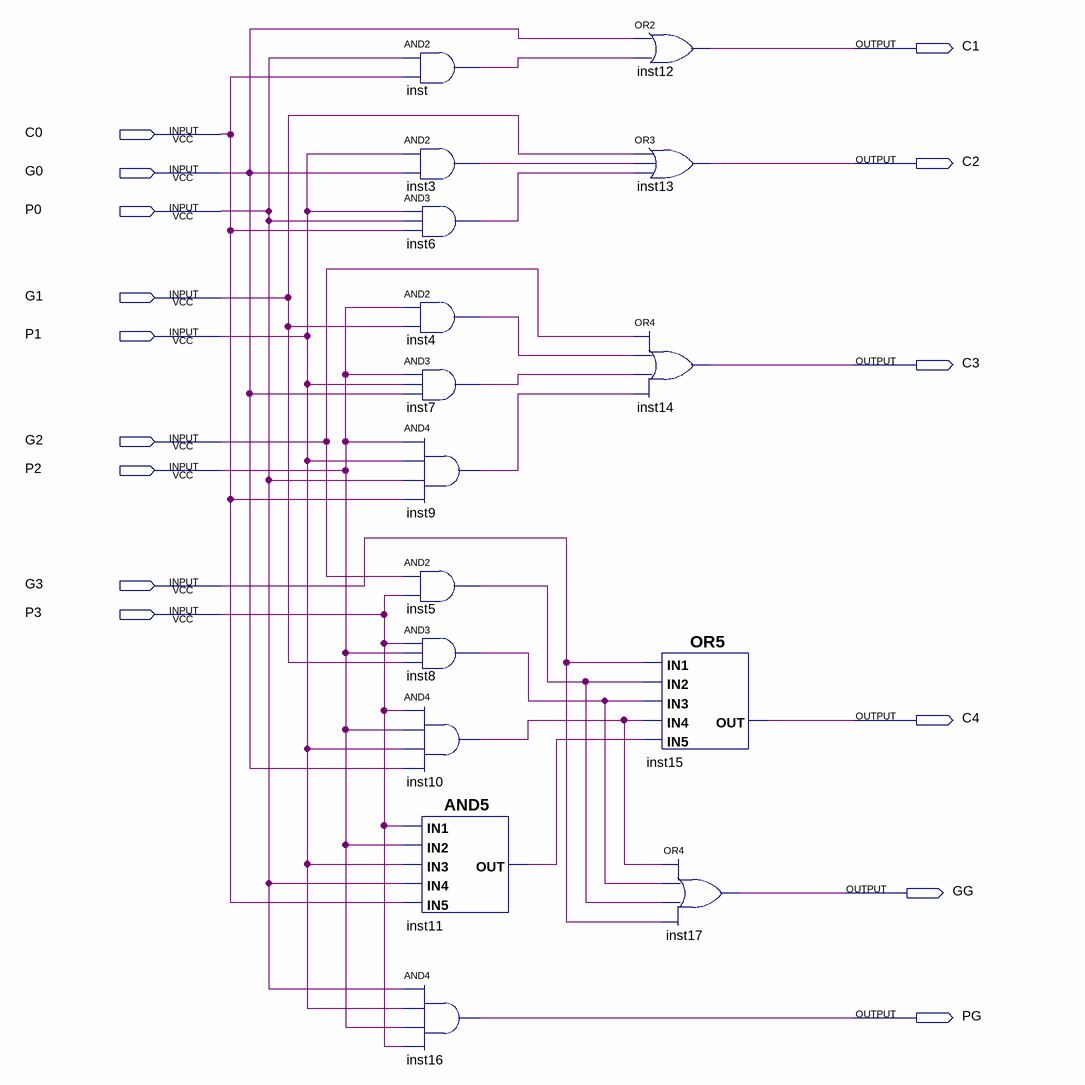
[diagram p0: schematic sheet]
// Quartus schematic CarryLookahead_4bit.bdf as structural Verilog: 16 symbols, 15 pins
module CarryLookahead_4bit (
  input  C0,
  input  G0,
  input  P0,
  input  G1,
  input  P1,
  input  G2,
  input  P2,
  input  G3,
  input  P3,
  output C1,
  output C2,
  output C3,
  output C4,
  output GG,
  output PG
);

  wire inst3_out, inst4_out, inst5_out, inst6_out, inst7_out, inst8_out, inst9_out, inst10_out, inst11_out,
       inst_out;

  and inst (inst_out, P0, C0);
  and inst3 (inst3_out, P1, G0);
  and inst6 (inst6_out, P1, P0, C0);
  and inst4 (inst4_out, P2, G1);
  and inst7 (inst7_out, P2, P1, G0);
  and inst9 (inst9_out, P2, P1, P0, C0);
  and inst5 (inst5_out, G2, P3);
  and inst8 (inst8_out, P3, P2, G1);
  and inst10 (inst10_out, P3, P2, P1, G0);
  and inst11 (inst11_out, P3, P2, P1, P0, C0);
  and inst16 (PG, P0, P1, P2, P3);
  or inst12 (C1, G0, inst_out);
  or inst13 (C2, G1, inst3_out, inst6_out);
  or inst14 (C3, G2, inst4_out, inst7_out, inst9_out);
  or inst15 (C4, G3, inst5_out, inst8_out, inst10_out, inst11_out);
  or inst17 (GG, inst10_out, inst8_out, inst5_out, G3);
endmodule
